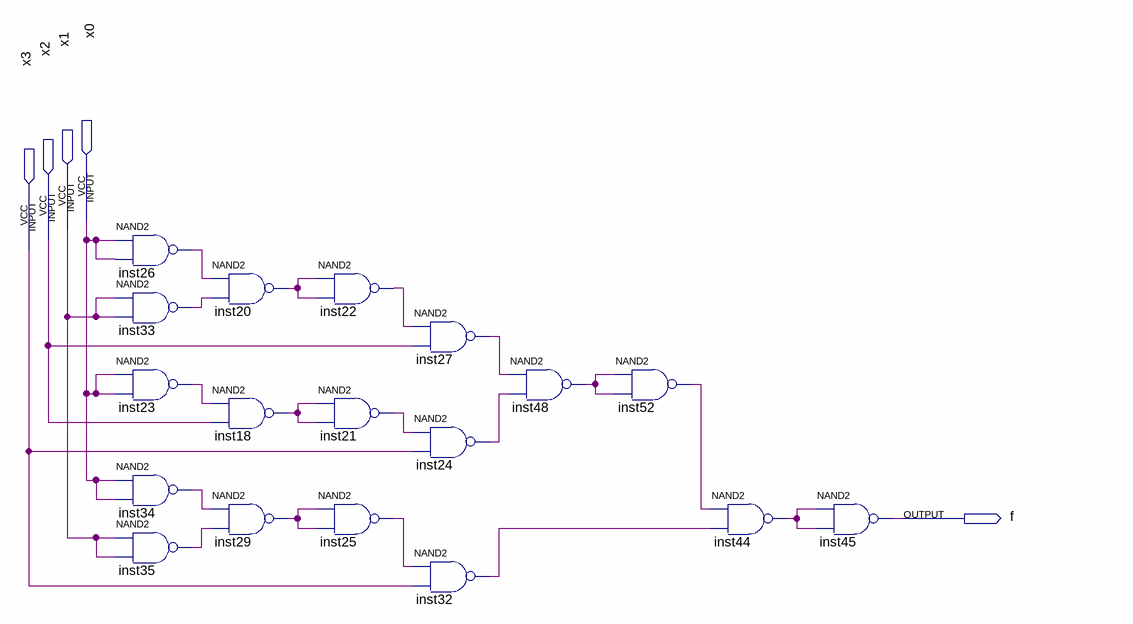
[diagram p0: schematic sheet]
// Quartus schematic DZ1_Quartus_F.bdf as structural Verilog: 18 symbols, 5 pins
module DZ1_Quartus_F (
  input  x0,
  input  x1,
  input  x2,
  input  x3,
  output f
);

  wire inst18_out, inst20_out, inst21_out, inst22_out, inst23_out, inst24_out, inst25_out, inst26_out,
       inst27_out, inst29_out, inst32_out, inst33_out, inst34_out, inst35_out, inst44_out, inst48_out,
       inst52_out;

  nand inst26 (inst26_out, x0, x0);
  nand inst33 (inst33_out, x1, x1);
  nand inst23 (inst23_out, x0, x0);
  nand inst34 (inst34_out, x0, x0);
  nand inst35 (inst35_out, x1, x1);
  nand inst20 (inst20_out, inst26_out, inst33_out);
  nand inst18 (inst18_out, inst23_out, x2);
  nand inst29 (inst29_out, inst34_out, inst35_out);
  nand inst22 (inst22_out, inst20_out, inst20_out);
  nand inst21 (inst21_out, inst18_out, inst18_out);
  nand inst25 (inst25_out, inst29_out, inst29_out);
  nand inst27 (inst27_out, inst22_out, x2);
  nand inst24 (inst24_out, inst21_out, x3);
  nand inst32 (inst32_out, inst25_out, x3);
  nand inst48 (inst48_out, inst27_out, inst24_out);
  nand inst52 (inst52_out, inst48_out, inst48_out);
  nand inst44 (inst44_out, inst52_out, inst32_out);
  nand inst45 (f, inst44_out, inst44_out);
endmodule
